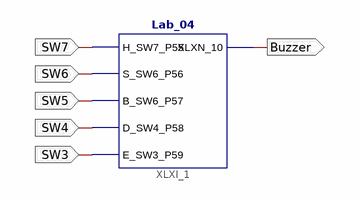
[diagram p0: schematic sheet 1]
// Xilinx ISE schematic moduleLab04.sch (spartan6) as structural Verilog: 1 symbols, 6 ports
module moduleLab04 (
  input  SW7,
  input  SW6,
  input  SW5,
  input  SW4,
  input  SW3,
  output Buzzer
);

  Lab_04 XLXI_1 (.H_SW7_P55(SW7), .S_SW6_P56(SW6), .B_SW6_P57(SW5), .D_SW4_P58(SW4), .E_SW3_P59(SW3), .XLXN_10(Buzzer));
endmodule
